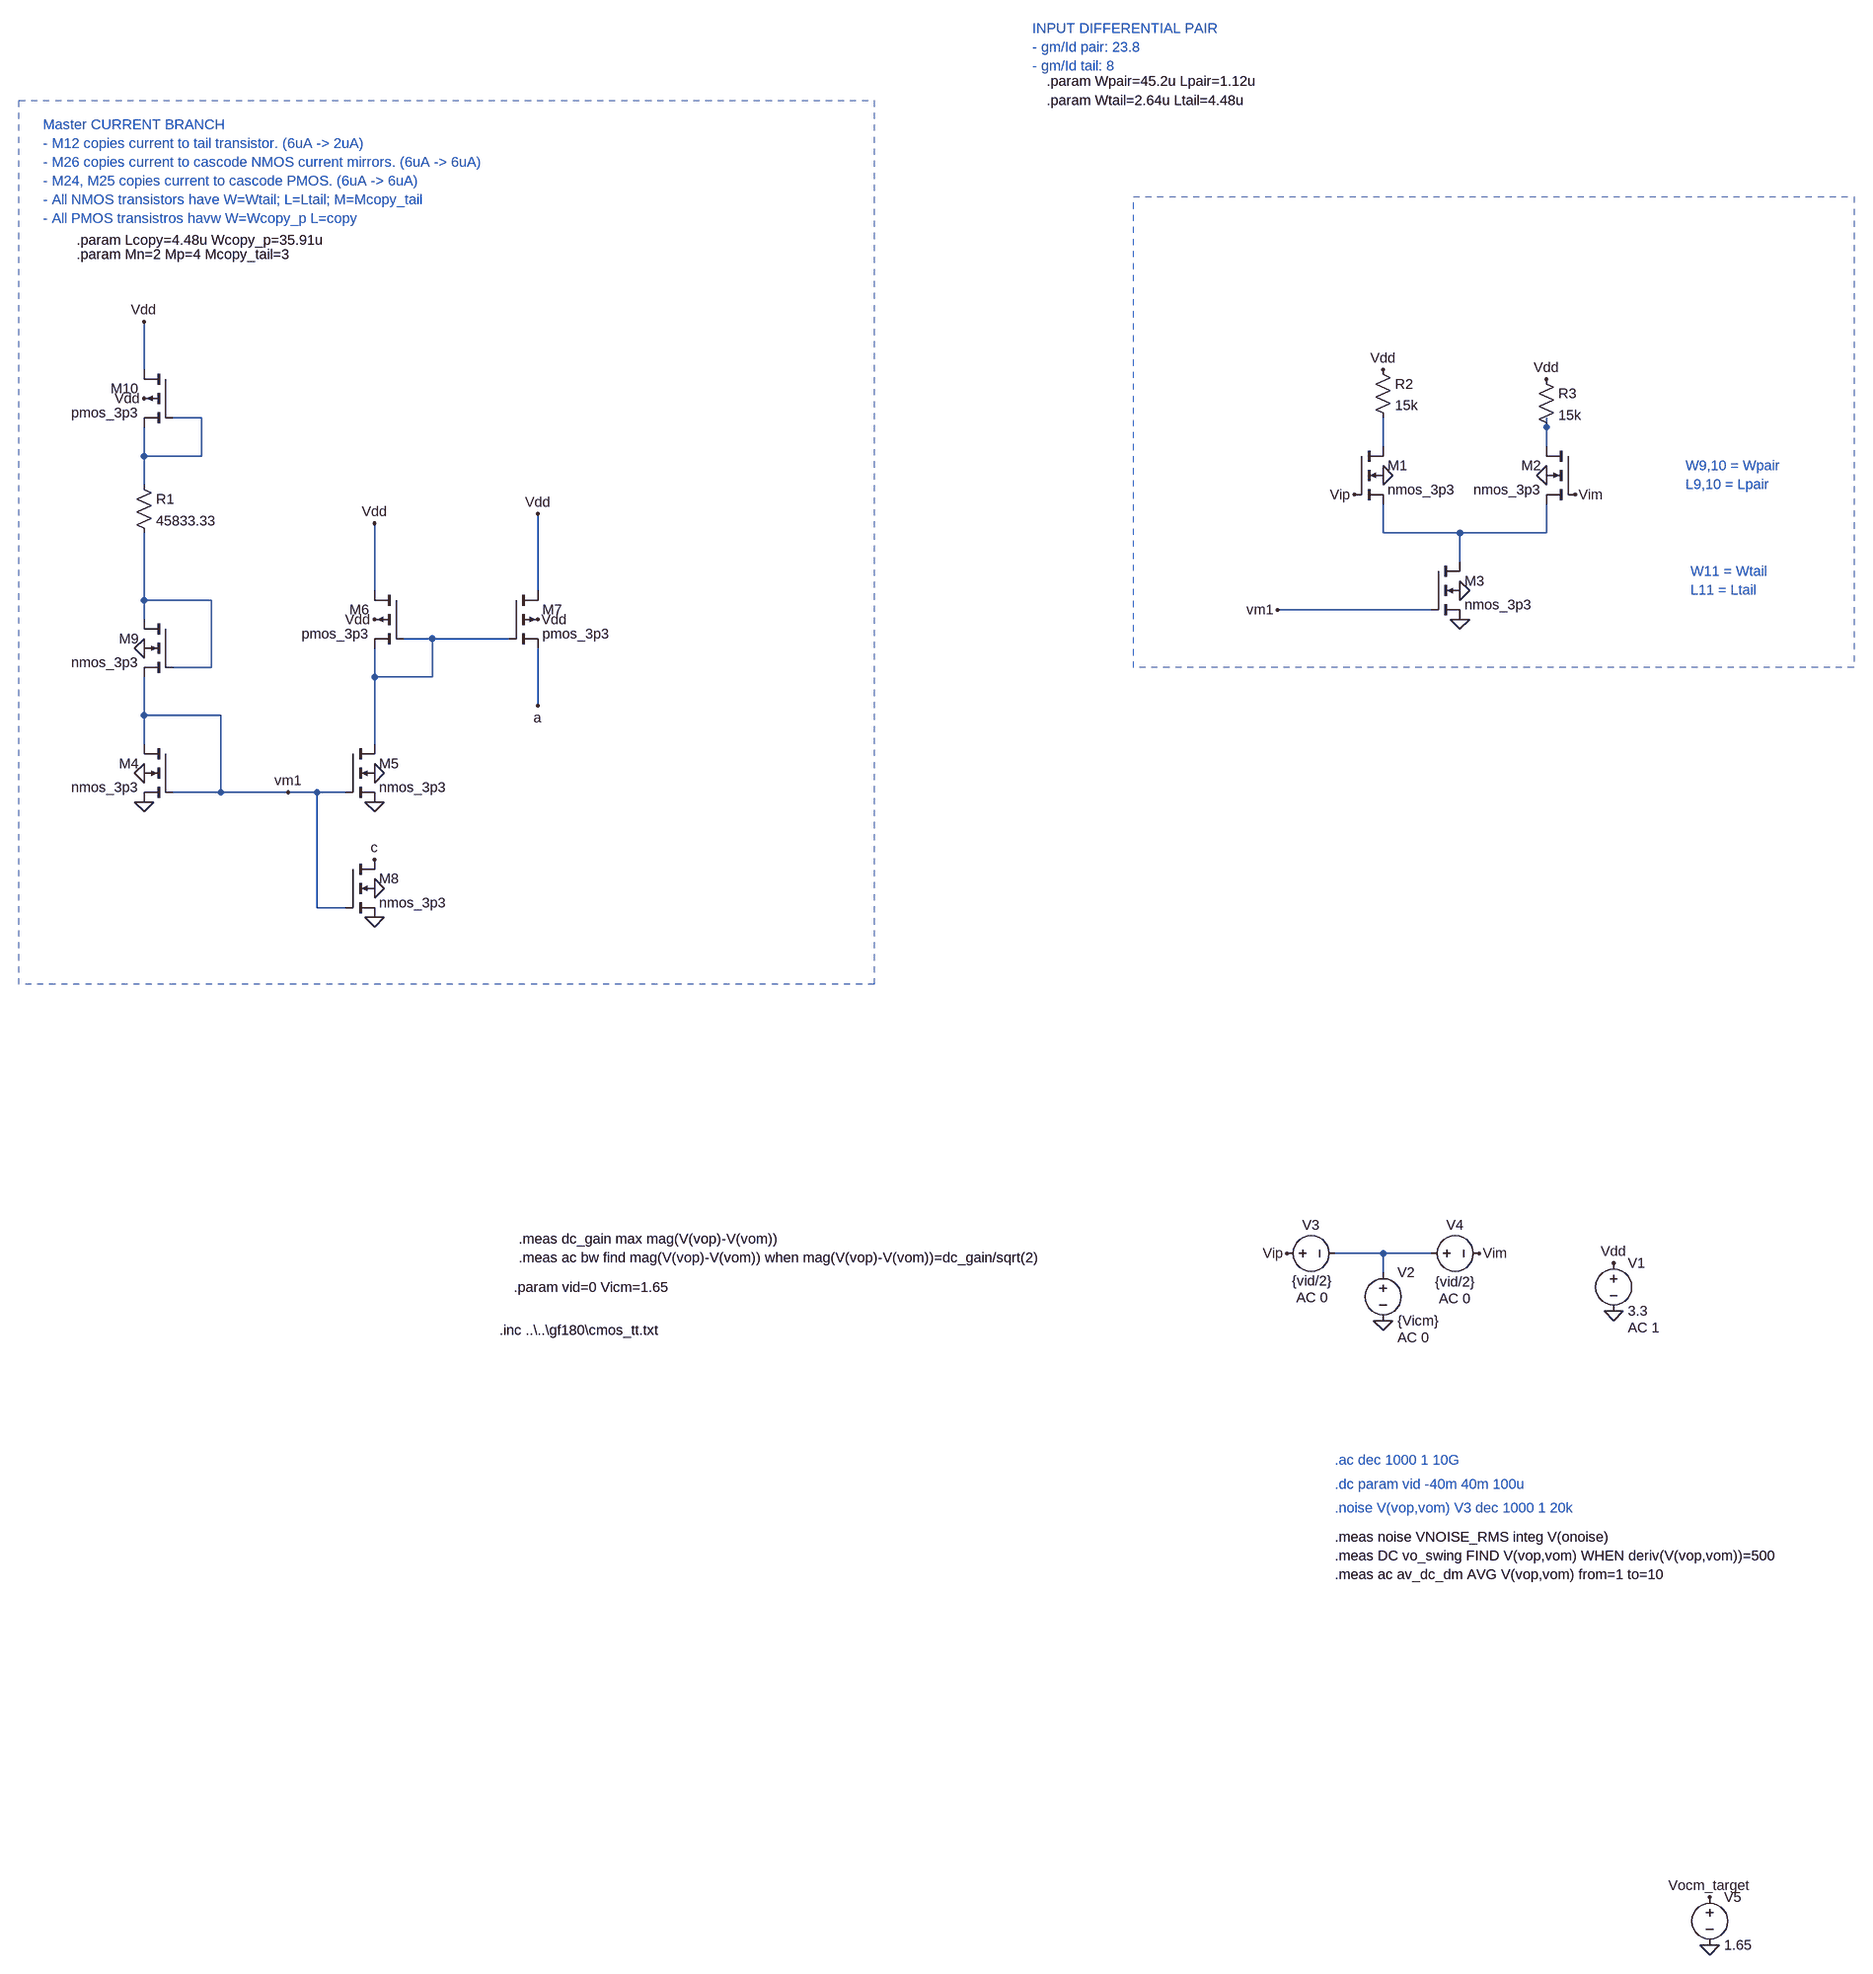
[diagram p0: schematic Draft2.asc]
Draft2.asc, the LTspice schematic file:
Version 4
SHEET 1 1300 1060
WIRE -1552 -1584 -1552 -1664
WIRE -1456 -1504 -1504 -1504
WIRE 784 -1488 784 -1504
WIRE 512 -1456 512 -1504
WIRE 784 -1456 784 -1488
WIRE -1552 -1440 -1552 -1488
WIRE -1456 -1440 -1456 -1504
WIRE -1456 -1440 -1552 -1440
WIRE -1552 -1392 -1552 -1440
WIRE 512 -1312 512 -1360
WIRE 640 -1312 512 -1312
WIRE 784 -1312 784 -1360
WIRE 784 -1312 640 -1312
WIRE 640 -1264 640 -1312
WIRE -1168 -1216 -1168 -1328
WIRE -896 -1216 -896 -1344
WIRE -1552 -1200 -1552 -1312
WIRE -1440 -1200 -1552 -1200
WIRE 592 -1184 336 -1184
WIRE -1552 -1168 -1552 -1200
WIRE -1072 -1136 -1120 -1136
WIRE -944 -1136 -1072 -1136
WIRE -1440 -1088 -1440 -1200
WIRE -1440 -1088 -1504 -1088
WIRE -1168 -1072 -1168 -1120
WIRE -1072 -1072 -1072 -1136
WIRE -1072 -1072 -1168 -1072
WIRE -896 -1024 -896 -1120
WIRE -1552 -1008 -1552 -1072
WIRE -1424 -1008 -1552 -1008
WIRE -1552 -960 -1552 -1008
WIRE -1168 -960 -1168 -1072
WIRE -1424 -880 -1424 -1008
WIRE -1424 -880 -1504 -880
WIRE -1312 -880 -1424 -880
WIRE -1264 -880 -1312 -880
WIRE -1216 -880 -1264 -880
WIRE -1264 -688 -1264 -880
WIRE -1216 -688 -1264 -688
WIRE 512 -112 432 -112
WIRE 592 -112 512 -112
WIRE 512 -80 512 -112
FLAG 640 -1168 0
FLAG 512 -1408 0
FLAG 784 -1408 0
FLAG 640 -1216 0
FLAG -1552 -864 0
FLAG -1552 -912 0
FLAG 896 -16 0
FLAG 896 -96 Vdd
FLAG 512 0 0
FLAG 352 -112 Vip
FLAG 672 -112 Vim
FLAG 464 -1376 Vip
FLAG 832 -1376 Vim
FLAG 1056 1040 0
FLAG 1056 960 Vocm_target
FLAG -1312 -880 vm1
FLAG 336 -1184 vm1
FLAG -1168 -864 0
FLAG -1168 -912 0
FLAG -1168 -1168 Vdd
FLAG -1168 -1328 Vdd
FLAG -896 -1168 Vdd
FLAG -896 -1344 Vdd
FLAG -896 -1024 a
FLAG -1168 -672 0
FLAG -1168 -720 0
FLAG -1168 -768 c
FLAG -1552 -1664 Vdd
FLAG -1552 -1120 0
FLAG -1552 -1536 Vdd
FLAG 512 -1584 Vdd
FLAG 784 -1568 Vdd
DATAFLAG 496 -1184 ""
DATAFLAG 656 -1312 ""
DATAFLAG 800 -1216 "Id(M11)"
DATAFLAG 384 -1488 "Id(M9)"
DATAFLAG 880 -1504 "Id(M9)"
DATAFLAG -1424 -928 ""
DATAFLAG -896 -1056 "Id(M25)"
DATAFLAG -1168 -800 "Id(M26)"
SYMBOL nmos4 464 -1456 R0
SYMATTR InstName M1
SYMATTR Value nmos_3p3
SYMATTR Value2 l='Lpair' w='Wpair' m=1
SYMBOL nmos4 832 -1456 M0
SYMATTR InstName M2
SYMATTR Value nmos_3p3
SYMATTR Value2 l='Lpair' w='Wpair' m=1
SYMBOL nmos4 592 -1264 R0
SYMATTR InstName M3
SYMATTR Value nmos_3p3
SYMATTR Value2 l='Ltail' w='Wtail' m=1
SYMBOL nmos4 -1504 -960 M0
SYMATTR InstName M4
SYMATTR Value nmos_3p3
SYMATTR Value2 l='Ltail' w='Wtail' m=Mcopy_tail
SYMBOL voltage 896 -112 R0
WINDOW 123 24 124 Left 2
WINDOW 39 0 0 Left 0
SYMATTR Value2 AC 1
SYMATTR InstName V1
SYMATTR Value 3.3
SYMBOL voltage 512 -96 R0
WINDOW 123 24 124 Left 2
WINDOW 39 0 0 Left 0
SYMATTR Value2 AC 0
SYMATTR InstName V2
SYMATTR Value {Vicm}
SYMBOL voltage 336 -112 R270
WINDOW 0 32 56 VTop 2
WINDOW 3 -30 58 VBottom 2
WINDOW 123 -58 58 VBottom 2
WINDOW 39 0 0 Left 0
SYMATTR InstName V3
SYMATTR Value {vid/2}
SYMATTR Value2 AC 0
SYMBOL voltage 576 -112 R270
WINDOW 0 32 56 VTop 2
WINDOW 3 -32 56 VBottom 2
WINDOW 123 -60 56 VBottom 2
WINDOW 39 0 0 Left 0
SYMATTR InstName V4
SYMATTR Value {vid/2}
SYMATTR Value2 AC 0
SYMBOL voltage 1056 944 R0
WINDOW 123 0 0 Left 0
WINDOW 39 0 0 Left 0
SYMATTR InstName V5
SYMATTR Value 1.65
SYMBOL nmos4 -1216 -960 R0
SYMATTR InstName M5
SYMATTR Value nmos_3p3
SYMATTR Value2 l='Ltail' w='Wtail' m=Mcopy_tail
SYMBOL pmos4 -1120 -1216 M0
SYMATTR InstName M6
SYMATTR Value pmos_3p3
SYMATTR Value2 l='Lcopy' w='Wcopy_p'
SYMBOL pmos4 -944 -1216 R0
SYMATTR InstName M7
SYMATTR Value pmos_3p3
SYMATTR Value2 l='Lcopy' w='Wcopy_p'
SYMBOL nmos4 -1216 -768 R0
SYMATTR InstName M8
SYMATTR Value nmos_3p3
SYMATTR Value2 l='Ltail' w='Wtail' m=Mcopy_tail
SYMBOL nmos4 -1504 -1168 M0
SYMATTR InstName M9
SYMATTR Value nmos_3p3
SYMATTR Value2 l='Ltail' w=2.64u m=3
SYMBOL pmos4 -1504 -1584 M0
SYMATTR InstName M10
SYMATTR Value pmos_3p3
SYMATTR Value2 l='Ltail' w='Wcopy_p'
SYMBOL res -1568 -1408 R0
SYMATTR InstName R1
SYMATTR Value 45833.33
SYMBOL res 496 -1600 R0
SYMATTR InstName R2
SYMATTR Value 15k
SYMBOL res 768 -1584 R0
SYMATTR InstName R3
SYMATTR Value 15k
TEXT -48 -2064 Left 2 !.param Wpair=45.2u Lpair=1.12u
TEXT -48 -2032 Left 2 !.param Wtail=2.64u Ltail=4.48u
TEXT -936 -56 Left 2 !.param vid=0 Vicm=1.65
TEXT -960 16 Left 2 !.inc ..\\..\\gf180\\cmos_tt.txt
TEXT 432 232 Left 2 ;.ac dec 1000 1 10G
TEXT 432 272 Left 2 ;.dc param vid -40m 40m 100u
TEXT -928 -136 Left 2 !.meas dc_gain max mag(V(vop)-V(vom))\n.meas ac bw find mag(V(vop)-V(vom)) when mag(V(vop)-V(vom))=dc_gain/sqrt(2)
TEXT -1664 -1800 Left 2 !.param Lcopy=4.48u Wcopy_p=35.91u
TEXT -1720 -1992 Left 2 ;Master CURRENT BRANCH\n- M12 copies current to tail transistor. (6uA -> 2uA)\n- M26 copies current to cascode NMOS current mirrors. (6uA -> 6uA)\n- M24, M25 copies current to cascode PMOS. (6uA -> 6uA)\n- All NMOS transistors have W=Wtail; L=Ltail; M=Mcopy_tail\n- All PMOS transistros havw W=Wcopy_p L=copy
TEXT -72 -2152 Left 2 ;INPUT DIFFERENTIAL PAIR\n- gm/Id pair: 23.8\n- gm/Id tail: 8
TEXT 432 312 Left 2 ;.noise V(vop,vom) V3 dec 1000 1 20k
TEXT 432 360 Left 2 !.meas noise VNOISE_RMS integ V(onoise)\n.meas DC vo_swing FIND V(vop,vom) WHEN deriv(V(vop,vom))=500\n.meas ac av_dc_dm AVG V(vop,vom) from=1 to=10
TEXT -1664 -1776 Left 2 !.param Mn=2 Mp=4 Mcopy_tail=3
TEXT 1016 -1424 Left 2 ;W9,10 = Wpair\nL9,10 = Lpair
TEXT 1024 -1248 Left 2 ;W11 = Wtail\nL11 = Ltail
RECTANGLE Normal 1296 -1088 96 -1872 2
RECTANGLE Normal -336 -560 -1760 -2032 2

The netlist it stands for:
* Draft2.asc
M1 N003 Vip N004 0 nmos_3p3 l='Lpair' w='Wpair' m=1
M2 N002 Vim N004 0 nmos_3p3 l='Lpair' w='Wpair' m=1
M3 N004 vm1 0 0 nmos_3p3 l='Ltail' w='Wtail' m=1
M4 vm1 vm1 0 0 nmos_3p3 l='Ltail' w='Wtail' m=Mcopy_tail
V1 Vdd 0 3.3 AC 1
V2 N007 0 {Vicm} AC 0
V3 Vip N007 {vid/2} AC 0
V4 N007 Vim {vid/2} AC 0
V5 Vocm_target 0 1.65
M5 N006 vm1 0 0 nmos_3p3 l='Ltail' w='Wtail' m=Mcopy_tail
M6 Vdd N006 N006 Vdd pmos_3p3 l='Lcopy' w='Wcopy_p'
M7 Vdd N006 a Vdd pmos_3p3 l='Lcopy' w='Wcopy_p'
M8 c vm1 0 0 nmos_3p3 l='Ltail' w='Wtail' m=Mcopy_tail
M9 N005 N005 vm1 0 nmos_3p3 l='Ltail' w=2.64u m=3
M10 Vdd N001 N001 Vdd pmos_3p3 l='Ltail' w='Wcopy_p'
R1 N001 N005 45833.33
R2 Vdd N003 15k
R3 Vdd N002 15k
.model NMOS NMOS
.model PMOS PMOS
.lib standard.mos
.param Wpair=45.2u Lpair=1.12u
.param Wtail=2.64u Ltail=4.48u
.param vid=0 Vicm=1.65
.inc ..\..\gf180\cmos_tt.txt
* .ac dec 1000 1 10G
* .dc param vid -40m 40m 100u
.meas dc_gain max mag(V(vop)-V(vom))
.meas ac bw find mag(V(vop)-V(vom)) when mag(V(vop)-V(vom))=dc_gain/sqrt(2)
.param Lcopy=4.48u Wcopy_p=35.91u
* Master CURRENT BRANCH
* - M12 copies current to tail transistor. (6uA -> 2uA)
* - M26 copies current to cascode NMOS current mirrors. (6uA -> 6uA)
* - M24, M25 copies current to cascode PMOS. (6uA -> 6uA)
* - All NMOS transistors have W=Wtail; L=Ltail; M=Mcopy_tail
* - All PMOS transistros havw W=Wcopy_p L=copy
* INPUT DIFFERENTIAL PAIR
* - gm/Id pair: 23.8
* - gm/Id tail: 8
* .noise V(vop,vom) V3 dec 1000 1 20k
.meas noise VNOISE_RMS integ V(onoise)
.meas DC vo_swing FIND V(vop,vom) WHEN deriv(V(vop,vom))=500
.meas ac av_dc_dm AVG V(vop,vom) from=1 to=10
.param Mn=2 Mp=4 Mcopy_tail=3
* W9,10 = Wpair
* L9,10 = Lpair
* W11 = Wtail
* L11 = Ltail
.backanno
.end